# EAGLE design rapidshark-dart-detector-mk-1.0 (EAGLE 6.5.0)
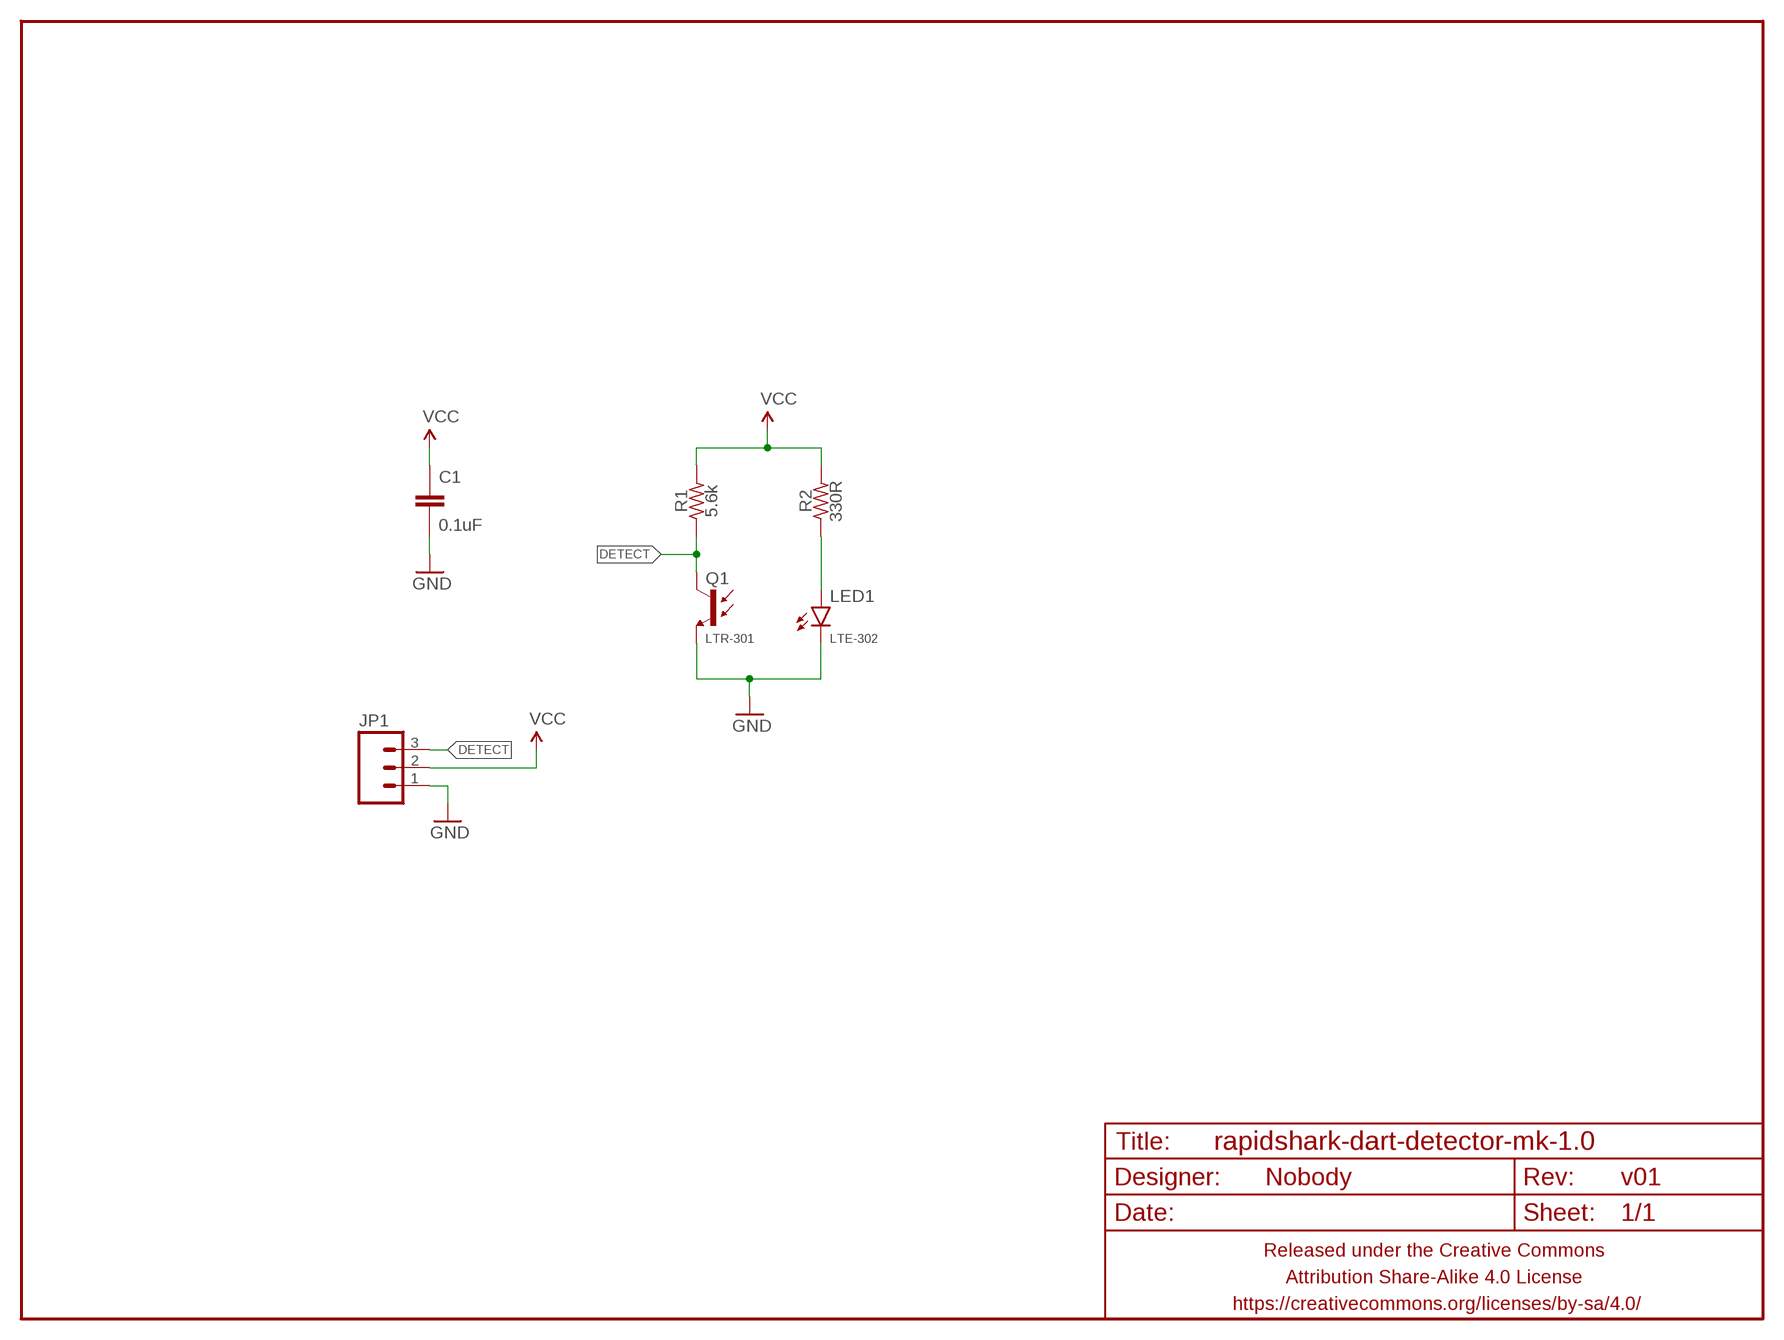
[diagram p0: schematic, sheet 1]

## Parts
C1  0.1uF  CAPACITOR-CERAMICC0805  [C0805]
FRAME1  FRAME-LETTERNO_PACKAGE  [DUMMY]
JP1  M03JST-PTH  [JST-3-PH-RA-PTH]
LED1  LTE-302  LED-VALUEIR-LED  [LED-2.54MM]
Q1  LTR-301  PHOTOTRANSISTOR2.54MM  [LED-2.54MM]
R1  5.6k  RESISTORR0805  [R0805]
R2  330R  RESISTORR0805  [R0805]

## Nets
DETECT: JP1.3 Q1.A(C) R1.1
GND: C1.2 JP1.1 LED1.K(C) Q1.K(E)
N$2: LED1.A R2.1
VCC: C1.1 JP1.2 R1.2 R2.2

## Library data of the parts
C1 = A_butts:CAPACITOR-CERAMIC: CAPACITOR, European symbol
FRAME1 = A_butts:FRAME-LETTER: Schematic Frame Standard 8.5x11 US Letter frame; DESIGNER: Nobody; VERSION: v01
JP1 = A_butts:M03: Header 3 Standard 3-pin 0.1" header. Use with straight break away headers (SKU : PRT-00116), right angle break away headers (PRT-00553), swiss pins (PRT-00743), machine pins (PRT-00117), and female headers (PRT-00115). Molex polarized connector foot print use with SKU : PRT-08232 with associated crimp pins and housings.; SKU: PRT-09915
LED1 = A_butts:LED-VALUE
Q1 = A_butts:PHOTOTRANSISTOR
R1 R2 = A_butts:RESISTOR: RESISTOR, American symbol

## Board
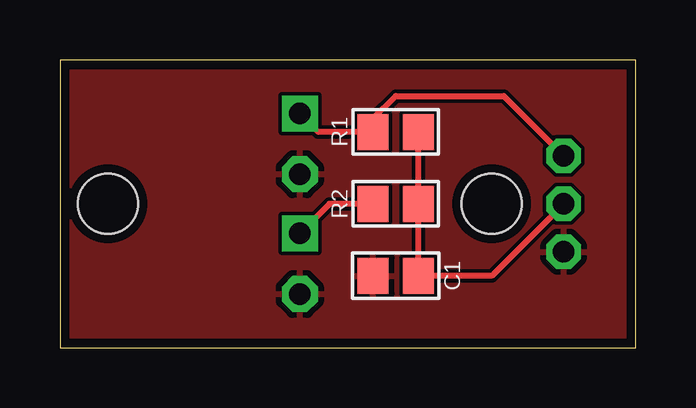
[diagram p1: board, top side]
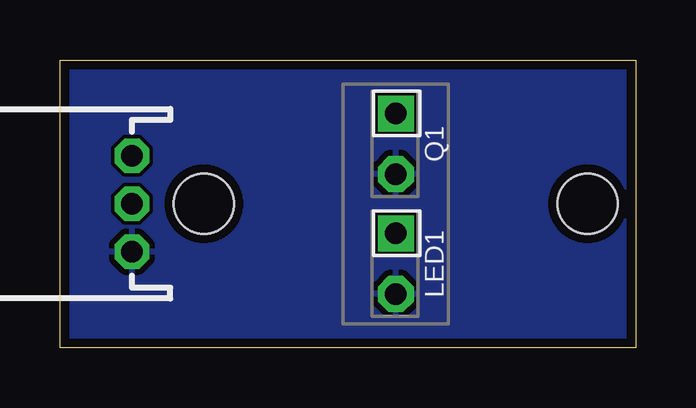
[diagram p2: board, bottom side, seen from below]

Size 24 x 12 mm. Coordinates in mm from the lower left corner, seen from the top.
Outline: 0,0 24,0 24,12 0,12 0,0
Copper layers (1*16): Top 0.0356mm / dielectric 1.5011mm / Bottom 0.0356mm
Design rules "LaenPCBOrder_2": minimum track width 6mil, minimum drill 13mil, track to track 6mil, track to pad 6mil, pad to pad 6mil, via to via 6mil, smd to smd 6mil, copper to edge 15mil, drill to drill 6mil, minimum pad ring 7mil, minimum via ring 7mil, stop-mask expansion 3mil, vias tented up to drill 20mil, thermal gap 10mil
Holes 2.5 mm at 2,6 18,6

### Footprints (pad centres in the part's own frame; a part is rotated, then mirrored left to right if it is on the bottom)
C0805 = smd 1.3 x 1.5: 1 -0.95,0; 2 0.95,0
JST-3-PH-RA-PTH = drill 0.9 pad 1.422 octagon: 1 -2,0; 2 0,0; 3 2,0
LED-2.54MM = drill 0.9 pad 1.5 square: A -1.27,0 | drill 0.9 pad 1.5 octagon: K 1.27,0
R0805 = smd 1.3 x 1.5: 1 -0.95,0; 2 0.95,0

### Placement (x,y rotation side)
C1  14,3 180 top
FRAME1  0,0 0 top
JP1  21,6 90 bottom
LED1  10,3.5 270 bottom
Q1  10,8.5 270 bottom
R1  14,9 0 top
R2  14,6 0 top

### Tracks (layer width: path | path; a pad name or v marks a point on that pad's centre or on a via)
DETECT
  Top 0.25: Q1.A 10.77,9 R1.1 13.05,9.55 14,10.5 18.5,10.5 JP1.3
GND
  pour Bottom (rank 5): 0,0 0,12 24,12 24,0
  pour Top (rank 5): 0,0 0,12 24,12 24,0
N$2
  Top 0.25: R2.1 11.23,6 LED1.A
VCC
  Top 0.25: JP1.2 18,3 C1.1 R2.2 R1.2